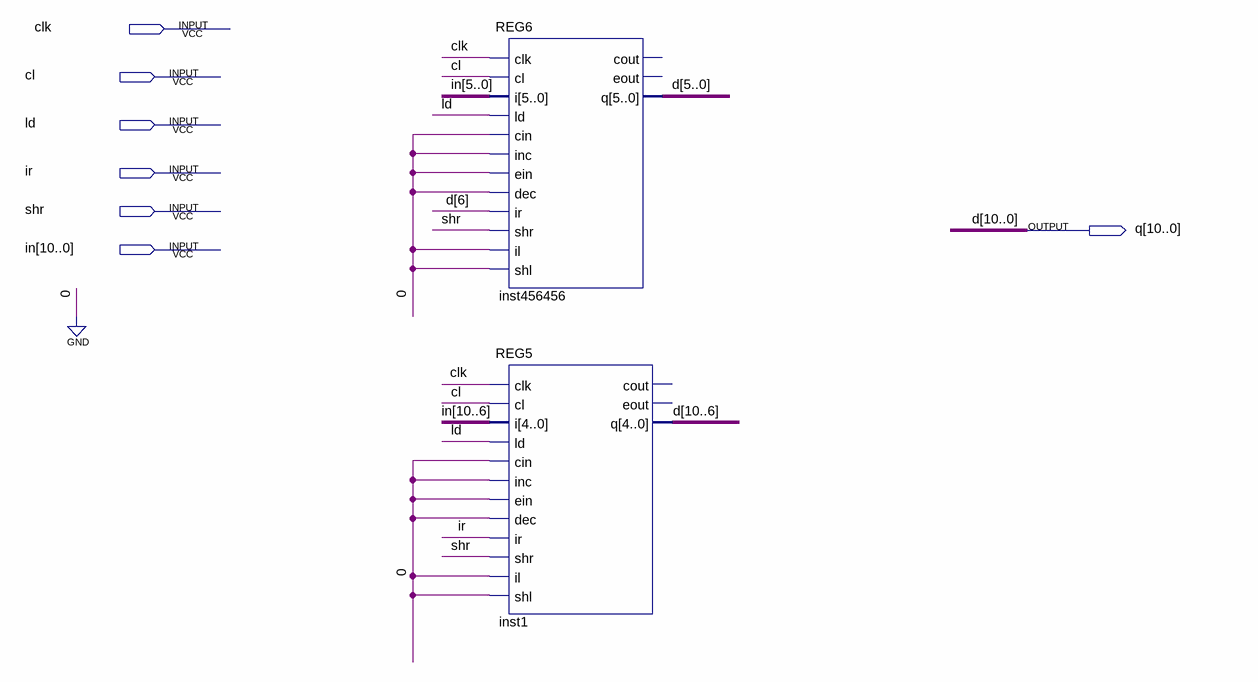
[diagram p0: schematic sheet]
// Quartus schematic REG11.bdf as structural Verilog: 2 symbols, 7 pins
module REG11 (
  input  clk,
  input  cl,
  input  ld,
  input  ir,
  input  shr,
  input  [10:0] in,
  output [10:0] q
);

  REG6 inst456456 (
    .clk(clk), .cl(cl), .i(in[5:0]), .ld(ld), .cin(1'b0), .inc(1'b0), .ein(1'b0), .dec(1'b0), .ir(q[6]),
    .shr(shr), .il(1'b0), .shl(1'b0), .q(q[5:0]));  // open: cout, eout
  REG5 inst1 (
    .clk(clk), .cl(cl), .i(in[10:6]), .ld(ld), .cin(1'b0), .inc(1'b0), .ein(1'b0), .dec(1'b0), .ir(ir),
    .shr(shr), .il(1'b0), .shl(1'b0), .q(q[10:6]));  // open: cout, eout

  // Other names for the same wires on the sheet: d[10:0] = q
endmodule
